# EAGLE design atx-psu-breakout_v1.1 (EAGLE 5.07)
PROJECT: ATX BREAKOUT BOARD V1.1
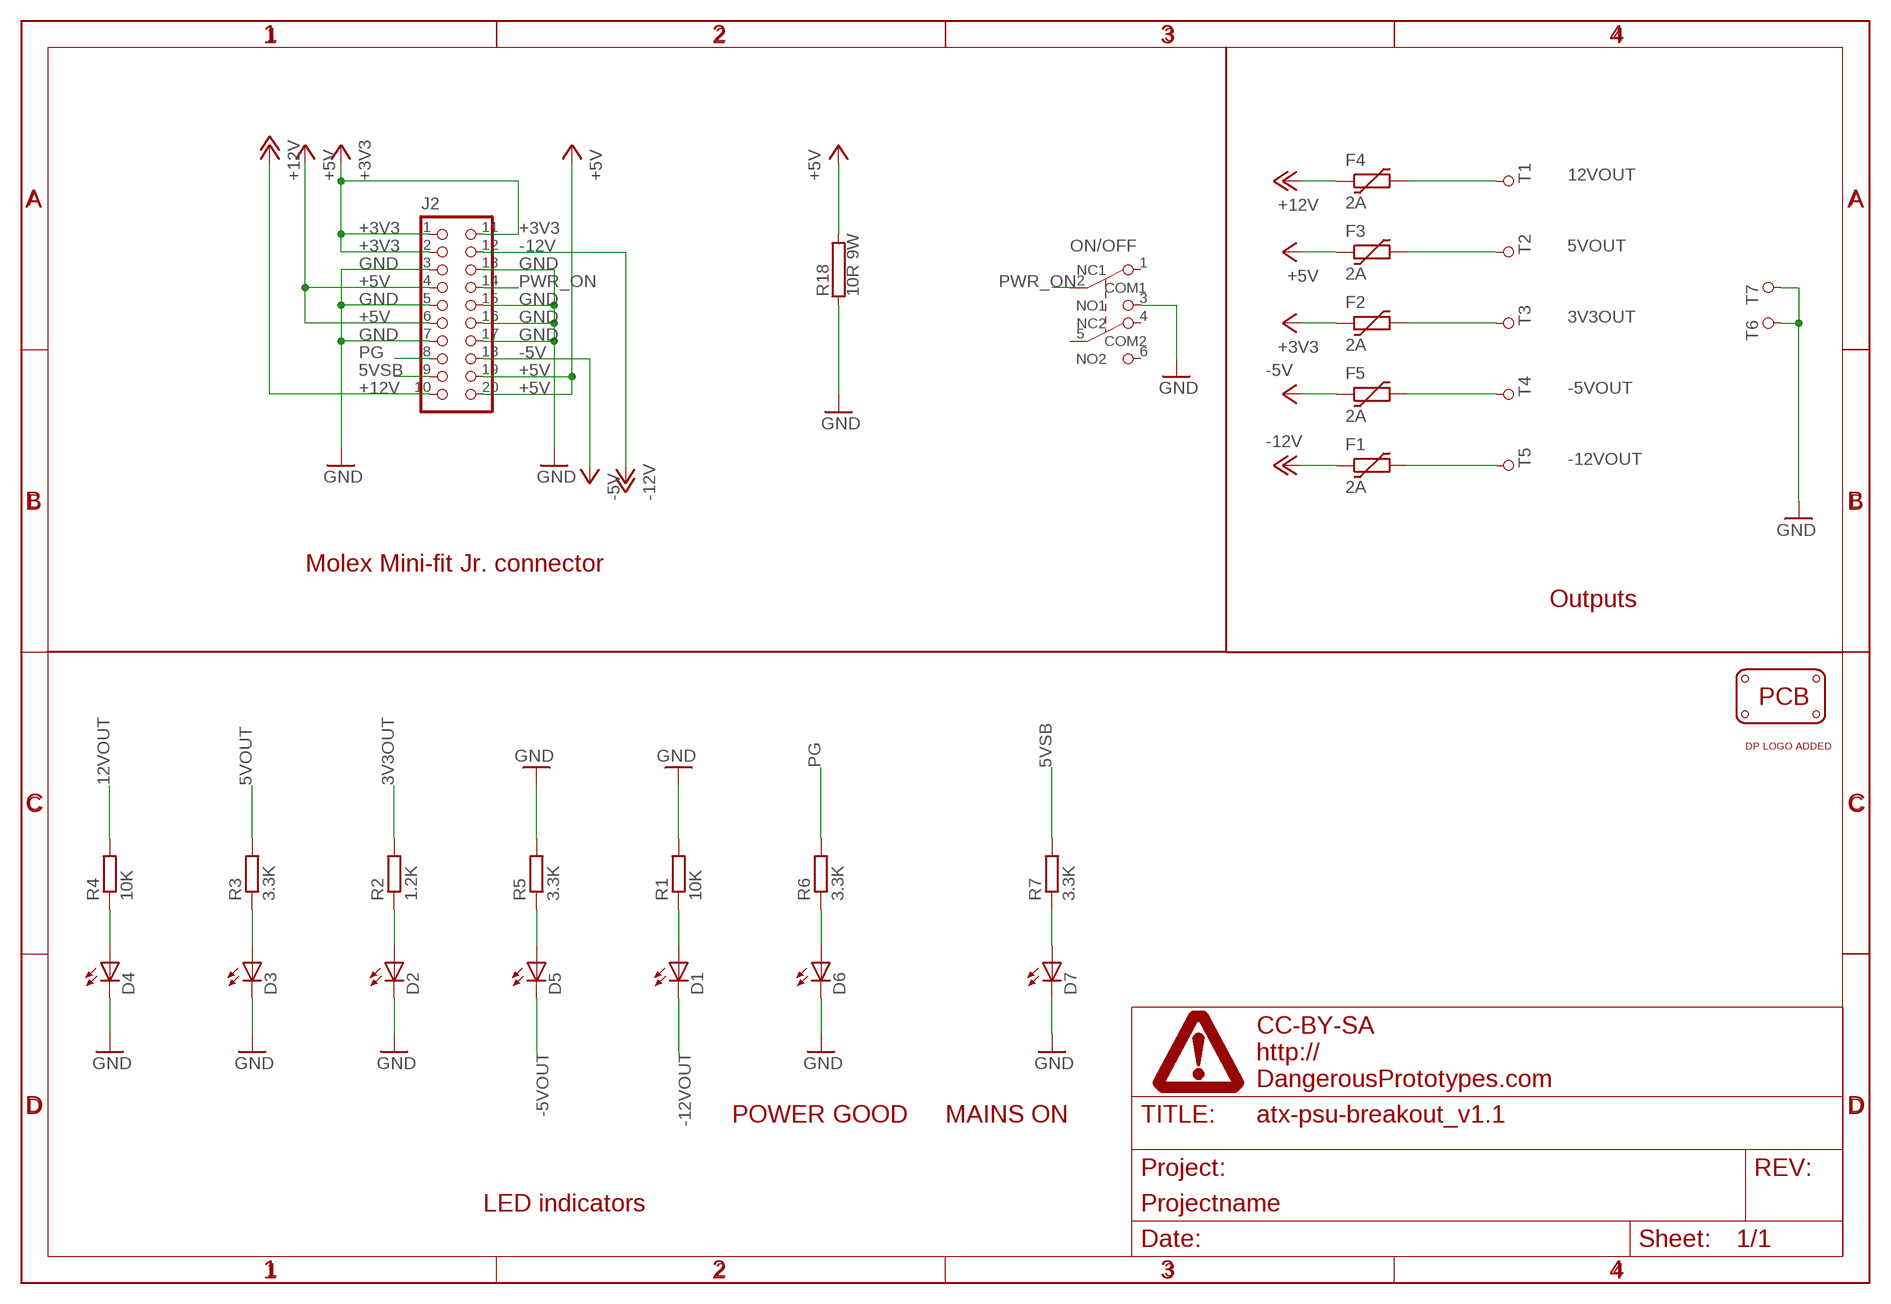
[diagram p0: schematic, sheet 1]

## Parts
D1  LED805  [LED-805]
D2  LED805  [LED-805]
D3  LED805  [LED-805]
D4  LED805  [LED-805]
D5  LED805  [LED-805]
D6  LED805  [LED-805]
D7  LED805  [LED-805]
F1  2A  FUSE_PTC-1812  [1812L_PTC]
F2  2A  FUSE_PTC-1812  [1812L_PTC]
F3  2A  FUSE_PTC-1812  [1812L_PTC]
F4  2A  FUSE_PTC-1812  [1812L_PTC]
F5  2A  FUSE_PTC-1812  [1812L_PTC]
J2  CON_ATX_PWR-90DEG  [CON_ATX_PWR_90DEG]
ON/OFF  SW_PUSH_DPDT  [SW_PUSH_BUTTON_MINI]
PCB2  PCB_DP_RECTANGLE-8X10  [PCB8X10]
R1  10K  RESISTORR603  [R603]
R2  1.2K  RESISTORR603  [R603]
R3  3.3K  RESISTORR603  [R603]
R4  10K  RESISTORR603  [R603]
R5  3.3K  RESISTORR603  [R603]
R6  3.3K  RESISTORR603  [R603]
R7  3.3K  RESISTORR603  [R603]
R18  10R 9W  RKH214-8  [KH214-8]
T1  PAD_TERMINAL-4.1MMROUND  [PAD_ROUND_4.1MM]
T2  PAD_TERMINAL-4.1MMROUND  [PAD_ROUND_4.1MM]
T3  PAD_TERMINAL-4.1MMROUND  [PAD_ROUND_4.1MM]
T4  PAD_TERMINAL-4.1MMROUND  [PAD_ROUND_4.1MM]
T5  PAD_TERMINAL-4.1MMROUND  [PAD_ROUND_4.1MM]
T6  PAD_TERMINAL-4.1MMROUND  [PAD_ROUND_4.1MM]
T7  PAD_TERMINAL-4.1MMROUND  [PAD_ROUND_4.1MM]
U$1  DINA4_L  [DP_LOGO@1]
U$6  LOGO_DP1.5X1.5  [DP_LOGO_ART_1.5X1.5]

## Nets
3V3OUT: F2.2 R2.2 T3.P
5VOUT: F3.2 R3.2 T2.P
5VSB: J2.9 R7.2
12VOUT: F4.2 R4.2 T1.P
+3V3: F2.1 J2.1 J2.2 J2.11
+5V: F3.1 J2.4 J2.6 J2.19 J2.20 R18.2
+12V: F4.1 J2.10
-5V: F5.1 J2.18
-5VOUT: D5.C F5.2 T4.P
-12V: F1.1 J2.12
-12VOUT: D1.C F1.2 T5.P
GND: D2.C D3.C D4.C D6.C D7.C J2.3 J2.5 J2.7 J2.13 J2.15 J2.16 J2.17 ON/OFF.3(NO1) R1.2 R5.2 R18.1 T6.P T7.P
N$2: D6.A R6.1
N$3: D7.A R7.1
N$15: D4.A R4.1
N$16: D3.A R3.1
N$18: D1.A R1.1
N$19: D2.A R2.1
N$20: D5.A R5.1
PG: J2.8 R6.2
PWR_ON: J2.14 ON/OFF.2(COM1)
Unconnected: ON/OFF.1(NC1) ON/OFF.4(NC2) ON/OFF.5(COM2) ON/OFF.6(NO2)

## Notes on the sheet
- Molex Mini-fit Jr. connector
- Outputs
- POWER GOOD | MAINS ON
- LED indicators

## Library data of the parts
D1-D7 = dp_devices:LED
F1-F5 = dp_devices:FUSE_PTC: Resettable PTC
J2 = dp_devices:CON_ATX_PWR
ON/OFF = dp_devices:SW_PUSH_DPDT
PCB2 = dp_devices:PCB_DP_RECTANGLE: Dangerous Prototypes Standard Rectangular PCB sizes
R1-R7 = dp_devices:RESISTOR
R18 = resistor-power:R: Power Resitor
T1-T7 = dp_devices:PAD_TERMINAL: Terminal connection pad
U$1 = dp_devices:DINA4_L: A4 DP frame Standard Dangerous Prototypes schematic frame. Automagically adds the DP logo and standard texts to the PCB Use the atrribute in the schematic editor to change the fields.; FF1: fulfillment by; FF2: Seeed Studio; FF3: www.seeedstudio.com; LICENSE: CC-BY-SA; PROJECT: Projectname; URL1: http://; URL2: DangerousPrototypes.com
U$6 = dp_devices:LOGO_DP

## Board
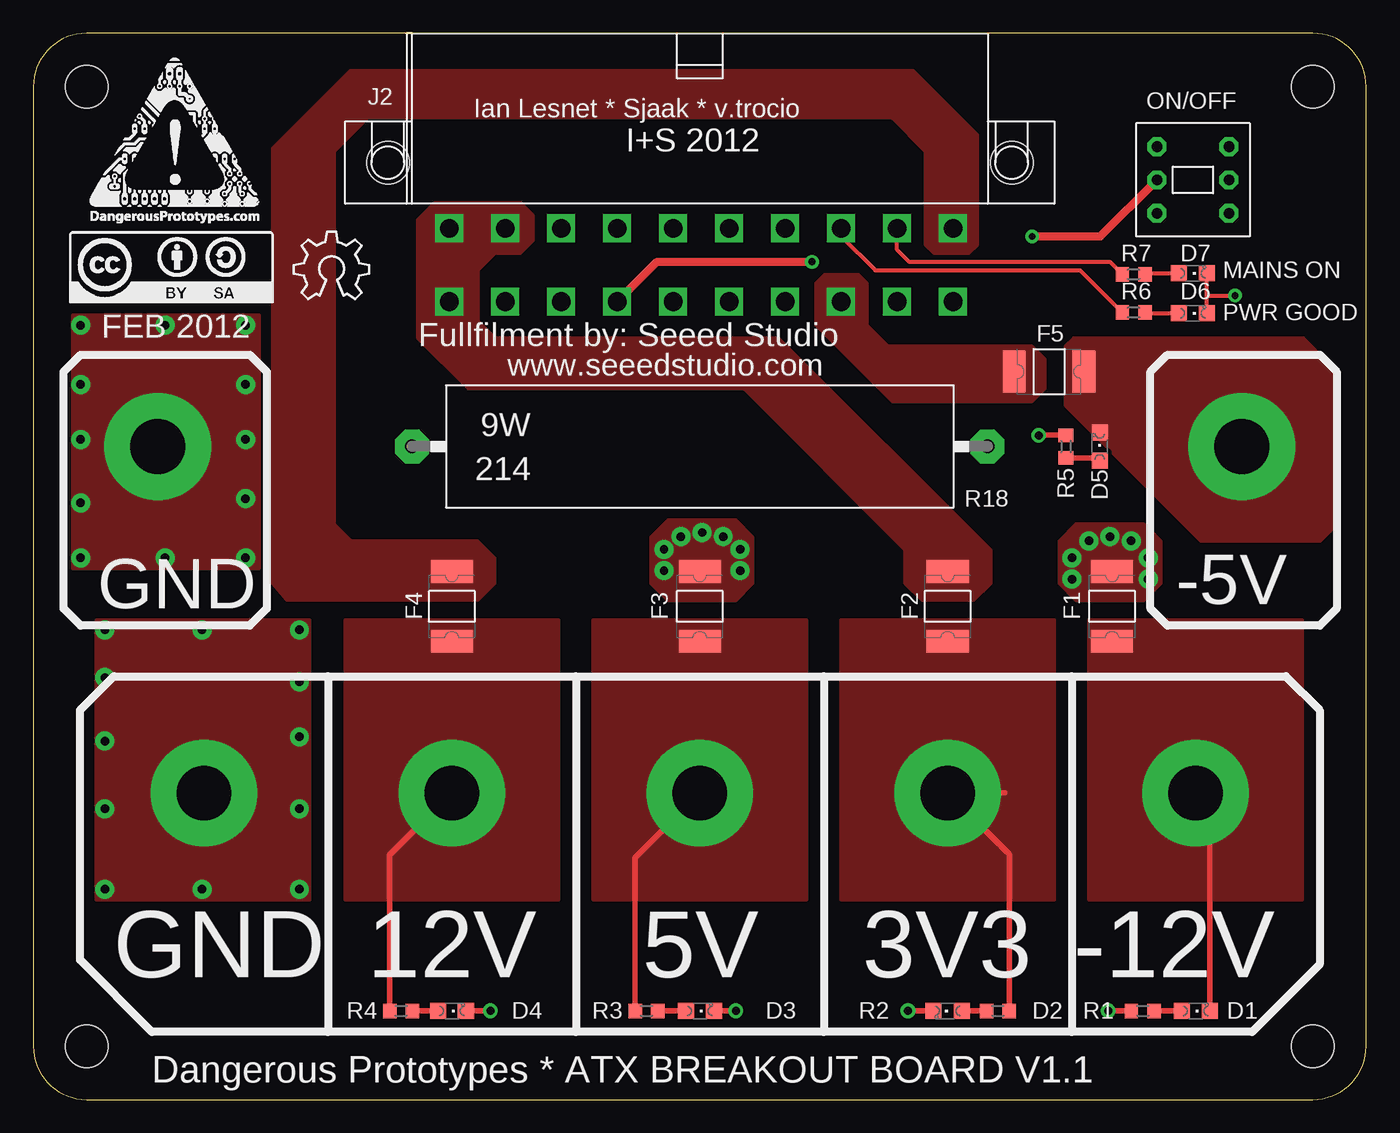
[diagram p1: board, top side]
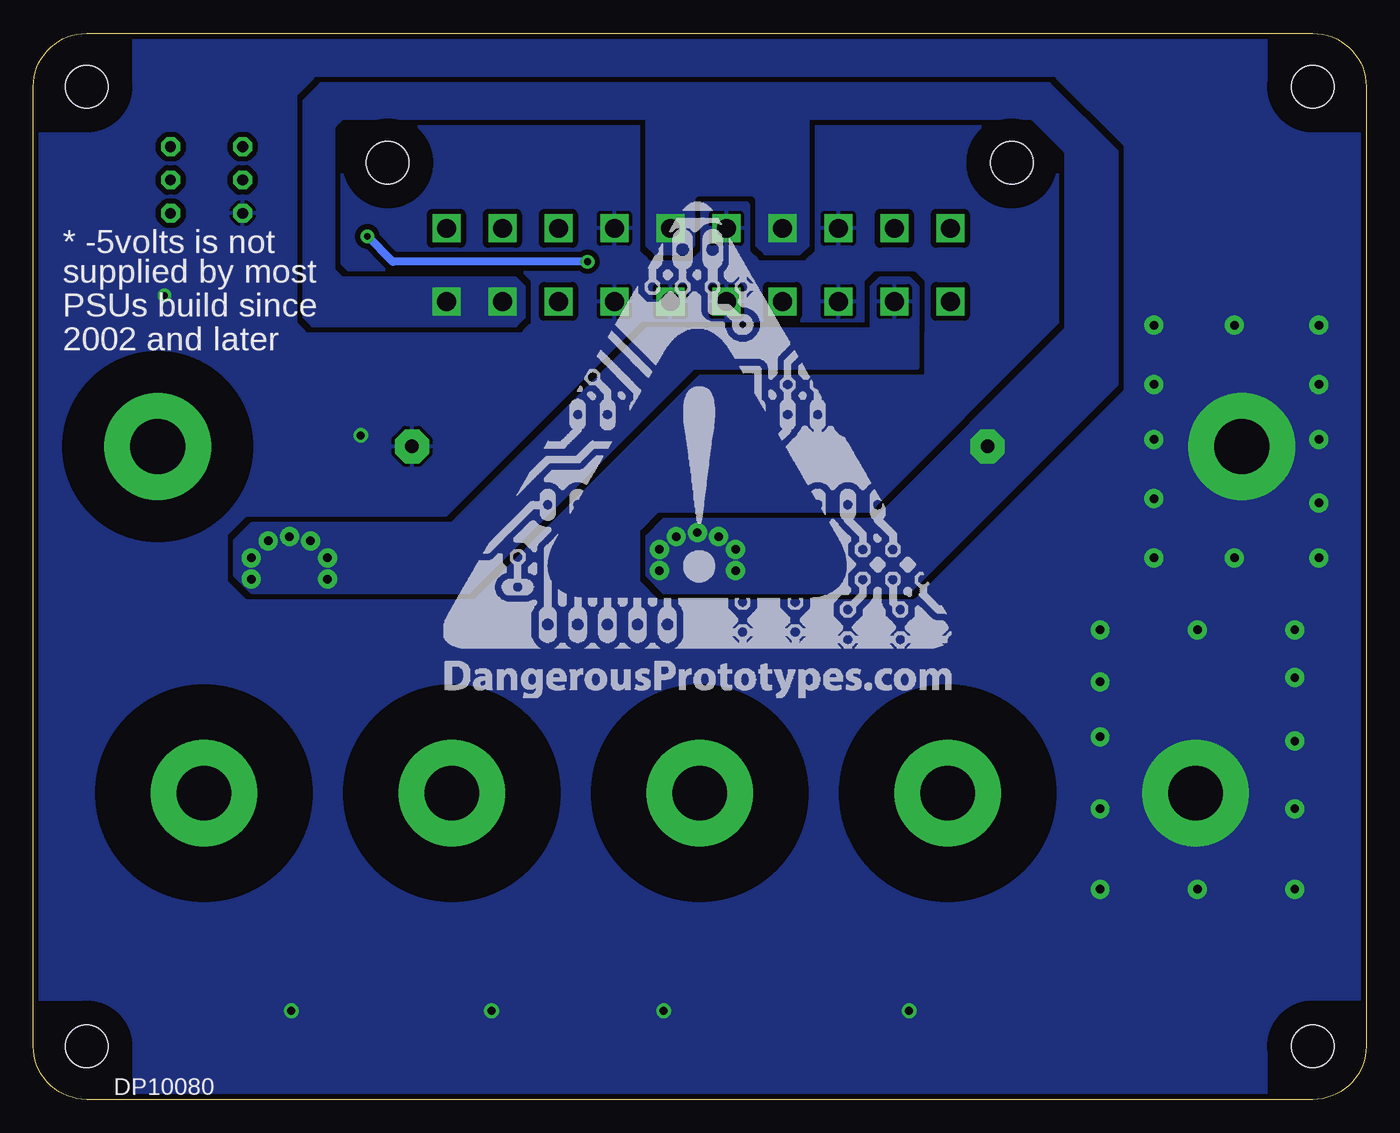
[diagram p2: board, bottom side, seen from below]

Size 100 x 80 mm. Coordinates in mm from the lower left corner, seen from the top.
Copper layers (1*16): Top 0.035mm / dielectric 1.5mm / Bottom 0.035mm
Design rules "SparkFun": minimum track width 8mil, minimum drill 20mil, track to track 8mil, track to pad 8mil, pad to pad 8mil, via to via 8mil, smd to smd 8mil, copper to edge 10mil, drill to drill 8mil, minimum pad ring 12mil, minimum via ring 10mil, stop-mask expansion 4mil, vias tented up to drill 25mil, thermal gap 10mil
tKeepout: area 79.7,15.5 to 94.7,30.5; area 61.1,15.5 to 76.1,30.5; area 61.1,15.5 to 76.1,30.5; area 23.9,15.5 to 38.9,30.5; area 42.5,15.5 to 57.5,30.5; area 83.2,41.5 to 98.2,56.5; area 1.8,41.5 to 16.8,56.5; area 4.9,15.5 to 19.9,30.5
bRestrict: area 25.4,17 to 37.4,29; area 44,17 to 56,29; area 62.6,17 to 74.6,29; area 81.2,17 to 93.2,29; area 85.2,43.5 to 96.2,54.5

### Footprints (pad centres in the part's own frame; a part is rotated, then mirrored left to right if it is on the bottom)
LED-805 = smd 1.2 x 1.2: A 0,-1.05; C 0,1.05
1812L_PTC = smd 1.7 x 3.15: 1 -2.62,0; 2 2.62,0
CON_ATX_PWR_90DEG = drill 1.4 square: 1 18.8,4.93; 2 14.6,4.93; 3 10.4,4.93; 4 6.2,4.93; 5 2,4.93; 6 -2.2,4.93; 7 -6.4,4.93; 8 -10.6,4.93; 9 -14.8,4.93; 10 -19,4.93; 11 18.8,10.43; 12 14.6,10.43; 13 10.4,10.43; 14 6.2,10.43; 15 2,10.43; 16 -2.2,10.43; 17 -6.4,10.43; 18 -10.6,10.43; 19 -14.8,10.43; 20 -19,10.43 | hole 3.2: 23.4,0; -23.4,0
SW_PUSH_BUTTON_MINI = drill 0.8 octagon: 1 2.5,2.7; 2 0,2.7; 3 -2.5,2.7; 4 2.5,-2.7; 5 0,-2.7; 6 -2.5,-2.7
PCB8X10 = hole 3.2: 4,4; 96,4; 96,76; 4,76
R603 = smd 1 x 1.1: 1 -0.85,0; 2 0.85,0
KH214-8 = drill 1.016 pad 2.54 octagon: 1 -21.59,0; 2 21.59,0
PAD_ROUND_4.1MM = drill 4.1 pad 8 round: P 0,0

### Placement (x,y rotation side)
D1  87.2,6.65 270 top
D2  68.6,6.65 90 top
D3  50,6.65 270 top
D4  31.4,6.65 270 top
D5  80.01,49 0 top
D6  87,59 270 top
D7  87,62 270 top
F1  80.93,37 270 top
F2  68.6,37 270 top
F3  50,37 270 top
F4  31.4,37 270 top
F5  76.2,54.61 0 top
J2  50,70.3 180 top
ON/OFF  87,69 90 top
PCB2  0,0 0 top
R1  83.23,6.65 180 top
R2  72.37,6.65 0 top
R3  46,6.65 180 top
R4  27.59,6.65 180 top
R5  77.47,49 90 top
R6  82.55,59.05 180 top
R7  82.55,61.91 180 top
R18  50,49 180 top
T1  31.4,23 180 top
T2  50,23 180 top
T3  68.6,23 180 top
T4  90.67,49 180 top
T5  87.2,23 180 top
T6  9.34,49 180 top
T7  12.8,23 180 top
U$1  1.91,-7.62 0 top  (outside the outline)
U$2  [DP_LOGO_ART_0.5X0.5]  4.25,65.77 0 top
U$3  [CC-BY-SA]  2.71,59.78 0 top
U$4  [OSHW_8X200_NOTEXT]  19.54,60.05 0 top
U$6  69.22,30.16 0 bottom

### Tracks (layer width: path | path; a pad name or v marks a point on that pad's centre or on a via)
3V3OUT
  Top 0.406: 72.89,23 T3.P 73.22,18.38 R2.2
  pour Top (no thermals): 76.6,15 71.62,14.93 60.6,15 60.6,36 76.6,36
5VOUT
  Top 0.406: R3.2 45.15,18.15 T2.P
  pour Top (no thermals): 58,36 58,15 42,15 42,36
5VSB
  Top 0.305: J2.9 64.8,63.77 65.71,62.85 80.76,62.85 R7.2
12VOUT
  Top 0.406: R4.2 26.74,18.34 T1.P
  pour Top (no thermals): 39.4,36 39.4,15 23.4,15 23.4,36
+3V3
  pour Top (isolate 0.305, no thermals): 70.52,37.47 66.71,37.47 65.44,38.73 65.44,41.24 53.34,53.34 52.07,53.34 32.69,53.33 28.88,57.14 28.88,66.03 30.15,67.3 36.5,67.3 37.45,66.35 37.45,64.44 36.5,63.49 34.59,63.49 33.33,62.22 33.33,58.41 34.59,57.14 54.61,57.15 55.88,57.15 71.79,41.24 71.79,38.73
+5V  (via drill 0.64 pad 1.42)
  other vias: 48.59,42.23 51.76,42.23 50.17,42.55 53.03,41.27 47.32,41.27 53.03,39.69 47.32,39.69
  pour Bottom (isolate 0.305, no thermals): 53.97,39.36 52.7,38.09 34.29,38.1 18.72,53.67 18.72,71.11 23.8,76.19 78.41,76.19 79.68,74.92 79.68,58.73 79.05,58.09 63.8,58.09 63.17,58.73 63.17,60.95 63.8,61.59 76.82,61.59 77.46,62.22 77.46,73.02 76.82,73.65 53.96,73.65 53.96,64.12 53.33,63.49 51.1,63.49 50.47,64.12 50.47,67.62 50.15,67.94 46.02,67.94 45.71,67.62 45.71,64.12 45.07,63.49 42.53,63.49 41.9,64.12 41.9,73.65 25.07,73.65 22.53,71.11 22.53,57.8 36.83,43.5 52.72,43.5 53.97,42.22
  pour Top (no thermals): 52.7,37.45 47.62,37.45 46.35,38.73 46.35,42.22 47.62,43.49 52.7,43.49 53.97,42.22 53.97,38.73
+12V
  pour Top (isolate 0.305, no thermals): 70.16,63.49 67.61,63.49 66.98,64.12 66.98,71.11 64.44,73.65 25.07,73.65 22.53,71.11 22.53,43.17 23.81,41.91 24.14,41.9 33.31,41.9 34.58,40.63 34.58,38.73 33.31,37.45 19.05,37.47 17.99,38.73 17.99,71.38 23.8,77.19 65.98,77.19 70.79,72.38 70.79,64.12
-5V
  pour Top (no thermals): 75.88,55.56 75.88,53.34 74.93,52.39 64.45,52.39 58.73,58.12 58.73,61.27 59.36,61.9 61.9,61.9 62.53,61.27 62.53,58.12 64.14,56.52 74.93,56.52
-5VOUT
  pour Top (isolate 0.305, no thermals): 78.11,57.15 95.25,57.15 97.79,54.61 97.79,43.18 96.52,41.91 87.63,41.91 77.47,52.07 77.47,56.52
-12V  (via drill 0.64 pad 1.42)
  other vias: 79.2,41.91 80.78,42.23 82.37,41.91 77.93,40.64 83.64,40.64 77.93,39.05 83.64,39.05
  pour Bottom (isolate 0.305): 84.9,39.36 83.63,38.09 67.31,38.1 50.48,54.93 33.66,54.93 33.64,60.95 34.28,61.59 36.5,61.59 37.13,60.95 37.13,57.77 53.98,57.77 68.58,43.18 83.63,43.17 84.9,41.9
  pour Top (no thermals): 84.58,38.73 83.31,37.45 78.23,37.45 76.96,38.73 76.96,41.9 78.23,43.17 83.31,43.17 84.58,41.9
-12VOUT
  Top 0.406: T5.P 88.53,23 | T5.P 86.15,21.95 | D1.C 88.25,21.95 T5.P
  pour Top (no thermals): 95.2,15 79.2,15 79.2,36 95.2,36
GND  (via drill 0.51, 0.6, 0.64 pad 1.42)
  Top 0.305: D6.C 88.05,60.33 | 88.05,60.33 D7.C | 88.05,60.33 v90.17,60.33
  Top 0.406: R5.2 75.45,49.85 v75.43,49.83 | v65.61,6.65 D2.C | 51.07,6.67 D3.C v52.7,6.65 | D4.C v34.29,6.65 | v80.64,6.65 R1.2
  other vias: 5.36,35.24 12.66,35.24 19.96,35.24 19.96,31.34 19.96,27.21 19.96,21.81 19.96,15.78 12.66,15.78 5.36,15.78 5.36,21.81 5.36,26.89 5.36,31.66 3.54,58.1 9.89,58.1 15.92,58.1 15.92,53.66 15.92,49.53 15.92,45.09 15.92,40.64 9.89,40.64 3.54,40.64 3.54,44.77 3.54,49.53 3.54,53.66
  pour Bottom (isolate 0.406, rank 6): 0,80 0,0 100,0 100,80
  pour Top: 20.72,36 20.72,15 4.72,15 4.72,36
  pour Top: 16.95,58.86 16.95,39.86 2.95,39.86 2.95,58.86
N$2
  Top 0.305: D6.A 83.45,59 R6.1
N$3
  Top 0.305: D7.A 83.49,62 R7.1
N$15
  Top 0.406: D4.A R4.1
N$16
  Top 0.406: R3.1 D3.A
N$18
  Top 0.406: D1.A R1.1
N$19
  Top 0.406: D2.A R2.1
N$20
  Top 0.406: R5.1 79.81,48.15 D5.A
PG
  Top 0.305: J2.8 60.6,64.79 63.17,62.22 78.53,62.22 R6.2
PWR_ON  (via drill 0.51)
  Top 0.61: v74.93,64.77 80.07,64.77 ON/OFF.2 | v58.42,62.87 46.8,62.87 J2.14
  Bottom 0.61: v58.42,62.87 73.03,62.87 v74.93,64.77

### Text on the board
tPlace: GND | -5V | GND | 12V | 5V | 3V3 | -12V
tNames: Ian Lesnet * Sjaak * v.trocio | I+S 2012 | MAINS ON | PWR GOOD | FEB 2012 | Fullfilment by: Seeed Studio | www.seeedstudio.com | Dangerous Prototypes * ATX BREAKOUT BOARD V1.1
bNames: * -5volts is not | supplied by most | PSUs build since | 2002 and later